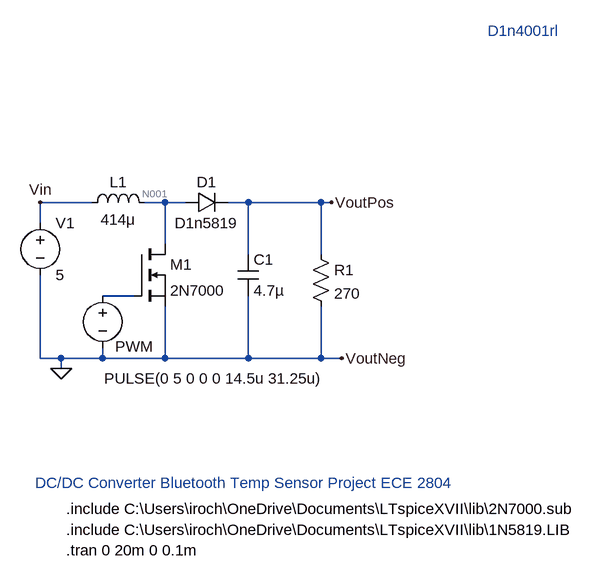
[diagram p0: schematic converter.asc]
converter.asc, the LTspice schematic file:
Version 4
SHEET 1 892 680
WIRE 48 -336 -32 -336
WIRE 160 -336 128 -336
WIRE 192 -336 160 -336
WIRE 288 -336 256 -336
WIRE 400 -336 288 -336
WIRE 416 -336 400 -336
WIRE -32 -304 -32 -336
WIRE 160 -272 160 -336
WIRE 288 -256 288 -336
WIRE 400 -256 400 -336
WIRE 112 -192 64 -192
WIRE -32 -96 -32 -224
WIRE 0 -96 -32 -96
WIRE 64 -96 64 -112
WIRE 64 -96 0 -96
WIRE 160 -96 160 -176
WIRE 160 -96 64 -96
WIRE 288 -96 288 -192
WIRE 288 -96 160 -96
WIRE 400 -96 400 -176
WIRE 400 -96 288 -96
WIRE 432 -96 400 -96
WIRE 0 -80 0 -96
FLAG 416 -336 VoutPos
FLAG 432 -96 VoutNeg
FLAG 0 -80 0
FLAG -32 -336 Vin
SYMBOL ind 32 -320 R270
WINDOW 0 32 56 VTop 2
WINDOW 3 5 56 VBottom 2
SYMATTR InstName L1
SYMATTR Value 414μ
SYMATTR SpiceLine Ipk=0.32 Rser=4.3 Rpar=365400 Cpar=18.263p
SYMBOL voltage -32 -320 R0
WINDOW 123 0 0 Left 0
WINDOW 39 0 0 Left 0
SYMATTR InstName V1
SYMATTR Value 5
SYMBOL cap 272 -256 R0
SYMATTR InstName C1
SYMATTR Value 4.7µ
SYMATTR SpiceLine Irms=31u
SYMBOL res 384 -272 R0
SYMATTR InstName R1
SYMATTR Value 270
SYMBOL nmos 112 -272 R0
SYMATTR InstName M1
SYMATTR Value 2N7000
SYMBOL voltage 64 -208 R0
WINDOW 0 19 94 Left 2
WINDOW 3 2 143 Left 2
WINDOW 123 19 122 Left 2
WINDOW 39 0 0 Left 0
SYMATTR InstName PWM
SYMATTR Value PULSE(0 5 0 0 0 14.5u 31.25u)
SYMBOL diode 192 -320 R270
WINDOW 0 32 32 VTop 2
WINDOW 3 0 32 VBottom 2
SYMATTR InstName D1
SYMATTR Value D1n5819
TEXT 8 136 Left 2 !.include C:\\Users\\iroch\\OneDrive\\Documents\\LTspiceXVII\\lib\\2N7000.sub
TEXT 8 168 Left 2 !.include C:\\Users\\iroch\\OneDrive\\Documents\\LTspiceXVII\\lib\\1N5819.LIB
TEXT -40 96 Left 2 ;DC/DC Converter Bluetooth Temp Sensor Project ECE 2804
TEXT 8 200 Left 2 !.tran 0 20m 0 0.1m
TEXT 656 -600 Left 2 ;D1n4001rl

The netlist it stands for:
* converter.asc
L1 Vin N001 414μ Ipk=0.32 Rser=4.3 Rpar=365400 Cpar=18.263p
V1 Vin 0 5
C1 VoutPos 0 4.7µ Irms=31u
R1 VoutPos 0 270
M1 N001 N002 0 0 2N7000
V§PWM N002 0 PULSE(0 5 0 0 0 14.5u 31.25u)
D1 N001 VoutPos D1n5819
.model D D
.lib standard.dio
.model NMOS NMOS
.model PMOS PMOS
.lib standard.mos
.include C:\Users\iroch\OneDrive\Documents\LTspiceXVII\lib\2N7000.sub
.include C:\Users\iroch\OneDrive\Documents\LTspiceXVII\lib\1N5819.LIB
* DC/DC Converter Bluetooth Temp Sensor Project ECE 2804
.tran 0 20m 0 0.1m
* D1n4001rl
.backanno
.end

* Results of the author's LTspice run, read from the files saved beside the schematic
* Operating Point, zero values left out:
*   V(vin) = 5 V
*   V(n001) = 4.925 V
*   V(voutpos) = 4.702 V
*   Id(M1) = 9.863 pA
*   Ib(M1) = -4.935 pA
*   Is(M1) = -4.925 pA
*   I(D1) = 17.41 mA
*   I(L1) = 17.41 mA
*   I(R1) = 17.41 mA
*   I(V1) = -17.41 mA